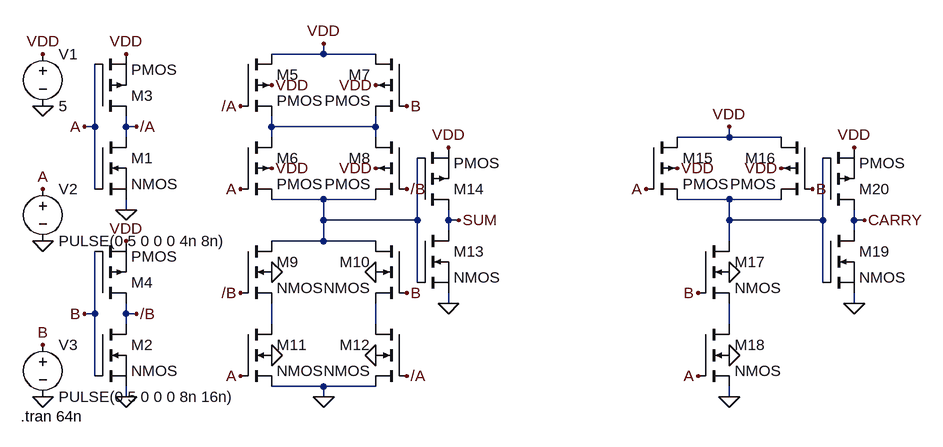
[diagram p0: schematic Half Adder.asc]
Half Adder.asc, the LTspice schematic file:
Version 4
SHEET 1 1376 680
WIRE 448 -64 448 -80
WIRE 448 -64 368 -64
WIRE 528 -64 448 -64
WIRE 96 48 96 -48
WIRE 96 48 80 48
WIRE 144 48 144 32
WIRE 160 48 144 48
WIRE 368 48 368 32
WIRE 528 48 528 32
WIRE 528 48 368 48
WIRE 144 64 144 48
WIRE 368 64 368 48
WIRE 528 64 528 48
WIRE 1072 64 1072 48
WIRE 1072 64 992 64
WIRE 1152 64 1072 64
WIRE 96 144 96 48
WIRE 448 160 368 160
WIRE 528 160 448 160
WIRE 1072 160 992 160
WIRE 1152 160 1072 160
WIRE 144 176 144 160
WIRE 448 192 448 160
WIRE 592 192 592 96
WIRE 592 192 448 192
WIRE 640 192 640 176
WIRE 656 192 640 192
WIRE 1072 192 1072 160
WIRE 1216 192 1216 96
WIRE 1216 192 1072 192
WIRE 1264 192 1264 176
WIRE 1280 192 1264 192
WIRE 640 208 640 192
WIRE 1264 208 1264 192
WIRE 448 224 448 192
WIRE 448 224 368 224
WIRE 528 224 448 224
WIRE 1072 224 1072 192
WIRE 592 288 592 192
WIRE 1216 288 1216 192
WIRE 640 320 640 304
WIRE 1264 320 1264 304
WIRE 96 336 96 240
WIRE 96 336 80 336
WIRE 144 336 144 320
WIRE 160 336 144 336
WIRE 144 352 144 336
WIRE 368 352 368 320
WIRE 528 352 528 320
WIRE 1072 352 1072 320
WIRE 96 432 96 336
WIRE 448 448 368 448
WIRE 528 448 448 448
WIRE 144 464 144 448
WIRE 448 464 448 448
WIRE 1072 464 1072 448
FLAG 16 16 0
FLAG 16 224 0
FLAG 16 464 0
FLAG 144 176 0
FLAG 144 464 0
FLAG 448 464 0
FLAG 1072 464 0
FLAG 1264 320 0
FLAG 640 320 0
FLAG 16 -64 VDD
FLAG 144 -64 VDD
FLAG 144 224 VDD
FLAG 448 -80 VDD
FLAG 640 80 VDD
FLAG 1072 48 VDD
FLAG 1264 80 VDD
FLAG 16 144 A
FLAG 80 48 A
FLAG 320 144 A
FLAG 320 432 A
FLAG 1024 432 A
FLAG 944 144 A
FLAG 160 48 /A
FLAG 320 16 /A
FLAG 576 432 /A
FLAG 80 336 B
FLAG 576 16 B
FLAG 576 304 B
FLAG 1024 304 B
FLAG 1200 144 B
FLAG 160 336 /B
FLAG 576 144 /B
FLAG 320 304 /B
FLAG 656 192 SUM
FLAG 1280 192 CARRY
FLAG 368 -16 VDD
FLAG 528 -16 VDD
FLAG 368 112 VDD
FLAG 528 112 VDD
FLAG 992 112 VDD
FLAG 1152 112 VDD
FLAG 368 272 0
FLAG 368 400 0
FLAG 528 272 0
FLAG 528 400 0
FLAG 1072 272 0
FLAG 1072 400 0
FLAG 16 384 B
SYMBOL nmos 96 64 R0
SYMATTR InstName M1
SYMBOL nmos 96 352 R0
SYMATTR InstName M2
SYMBOL pmos 96 32 M180
SYMATTR InstName M3
SYMBOL pmos 96 320 M180
SYMATTR InstName M4
SYMBOL pmos4 320 -64 R0
SYMATTR InstName M5
SYMBOL pmos4 320 64 R0
SYMATTR InstName M6
SYMBOL pmos4 576 -64 M0
SYMATTR InstName M7
SYMBOL pmos4 576 64 M0
SYMATTR InstName M8
SYMBOL nmos4 320 224 R0
SYMATTR InstName M9
SYMBOL nmos4 576 224 M0
SYMATTR InstName M10
SYMBOL nmos4 320 352 R0
SYMATTR InstName M11
SYMBOL nmos4 576 352 M0
SYMATTR InstName M12
SYMBOL nmos 592 208 R0
SYMATTR InstName M13
SYMBOL pmos 592 176 M180
SYMATTR InstName M14
SYMBOL pmos4 944 64 R0
SYMATTR InstName M15
SYMBOL pmos4 1200 64 M0
SYMATTR InstName M16
SYMBOL nmos4 1024 224 R0
SYMATTR InstName M17
SYMBOL nmos4 1024 352 R0
SYMATTR InstName M18
SYMBOL nmos 1216 208 R0
SYMATTR InstName M19
SYMBOL pmos 1216 176 M180
SYMATTR InstName M20
SYMBOL voltage 16 -80 R0
SYMATTR InstName V1
SYMATTR Value 5
SYMBOL voltage 16 128 R0
WINDOW 123 0 0 Left 0
WINDOW 39 0 0 Left 0
SYMATTR InstName V2
SYMATTR Value PULSE(0 5 0 0 0 4n 8n)
SYMBOL voltage 16 368 R0
WINDOW 123 0 0 Left 0
WINDOW 39 0 0 Left 0
SYMATTR InstName V3
SYMATTR Value PULSE(0 5 0 0 0 8n 16n)
TEXT -18 494 Left 2 !.tran 64n

The netlist it stands for:
* Half Adder.asc
M1 /A A 0 0 NMOS
M2 /B B 0 0 NMOS
M3 /A A VDD VDD PMOS
M4 /B B VDD VDD PMOS
M5 VDD /A N001 VDD PMOS
M6 N001 A N002 VDD PMOS
M7 VDD B N001 VDD PMOS
M8 N001 /B N002 VDD PMOS
M9 N002 /B N004 0 NMOS
M10 N002 B N005 0 NMOS
M11 N004 A 0 0 NMOS
M12 N005 /A 0 0 NMOS
M13 SUM N002 0 0 NMOS
M14 SUM N002 VDD VDD PMOS
M15 VDD A N003 VDD PMOS
M16 VDD B N003 VDD PMOS
M17 N003 B N006 0 NMOS
M18 N006 A 0 0 NMOS
M19 CARRY N003 0 0 NMOS
M20 CARRY N003 VDD VDD PMOS
V1 VDD 0 5
V2 A 0 PULSE(0 5 0 0 0 4n 8n)
V3 B 0 PULSE(0 5 0 0 0 8n 16n)
.model NMOS NMOS
.model PMOS PMOS
.lib standard.mos
.tran 64n
.backanno
.end